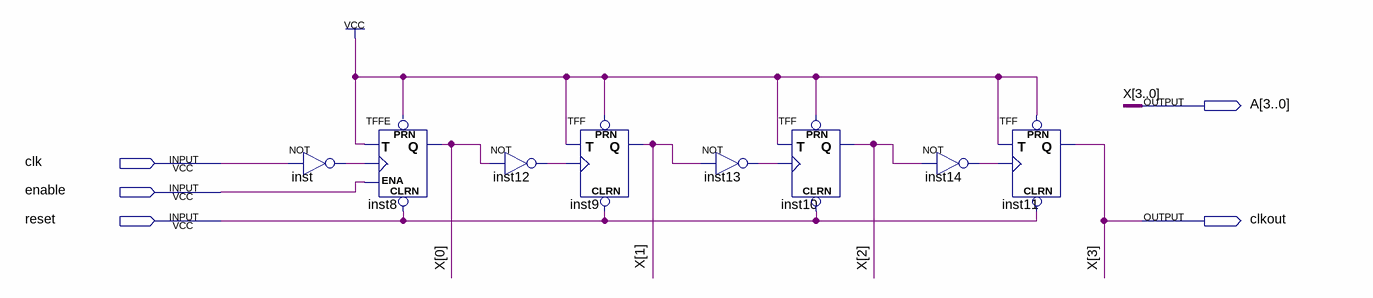
[diagram p0: schematic sheet]
// Quartus schematic counter.bdf as structural Verilog: 8 symbols, 5 pins
module counter (
  input  clk,
  input  enable,
  input  reset,
  output [3:0] A,
  output clkout
);

  wire inst12_out, inst13_out, inst14_out, inst_out;

  not inst (inst_out, clk);
  TFFE inst8 (.CLRN(reset), .T(1'b1), .CLK(inst_out), .ENA(enable), .PRN(1'b1), .Q(A[0]));
  not inst12 (inst12_out, A[0]);
  TFF inst9 (.PRN(1'b1), .CLRN(reset), .T(1'b1), .CLK(inst12_out), .Q(A[1]));
  not inst13 (inst13_out, A[1]);
  TFF inst10 (.PRN(1'b1), .CLRN(reset), .T(1'b1), .CLK(inst13_out), .Q(A[2]));
  not inst14 (inst14_out, A[2]);
  TFF inst11 (.PRN(1'b1), .CLRN(reset), .T(1'b1), .CLK(inst14_out), .Q(A[3]));

  assign clkout = A[3];

  // Other names for the same wires on the sheet: X[3:0] = A
endmodule
